# Altium schematic sheet main.SchDoc: 2306-rj45-connector
size 420 x 297 mm; Date: 2021-12-08; Author: Joachim Löfwander; Revision: AAA-000; SheetNumber: 1; SheetTotal: 1; Website: github.com/jlofw
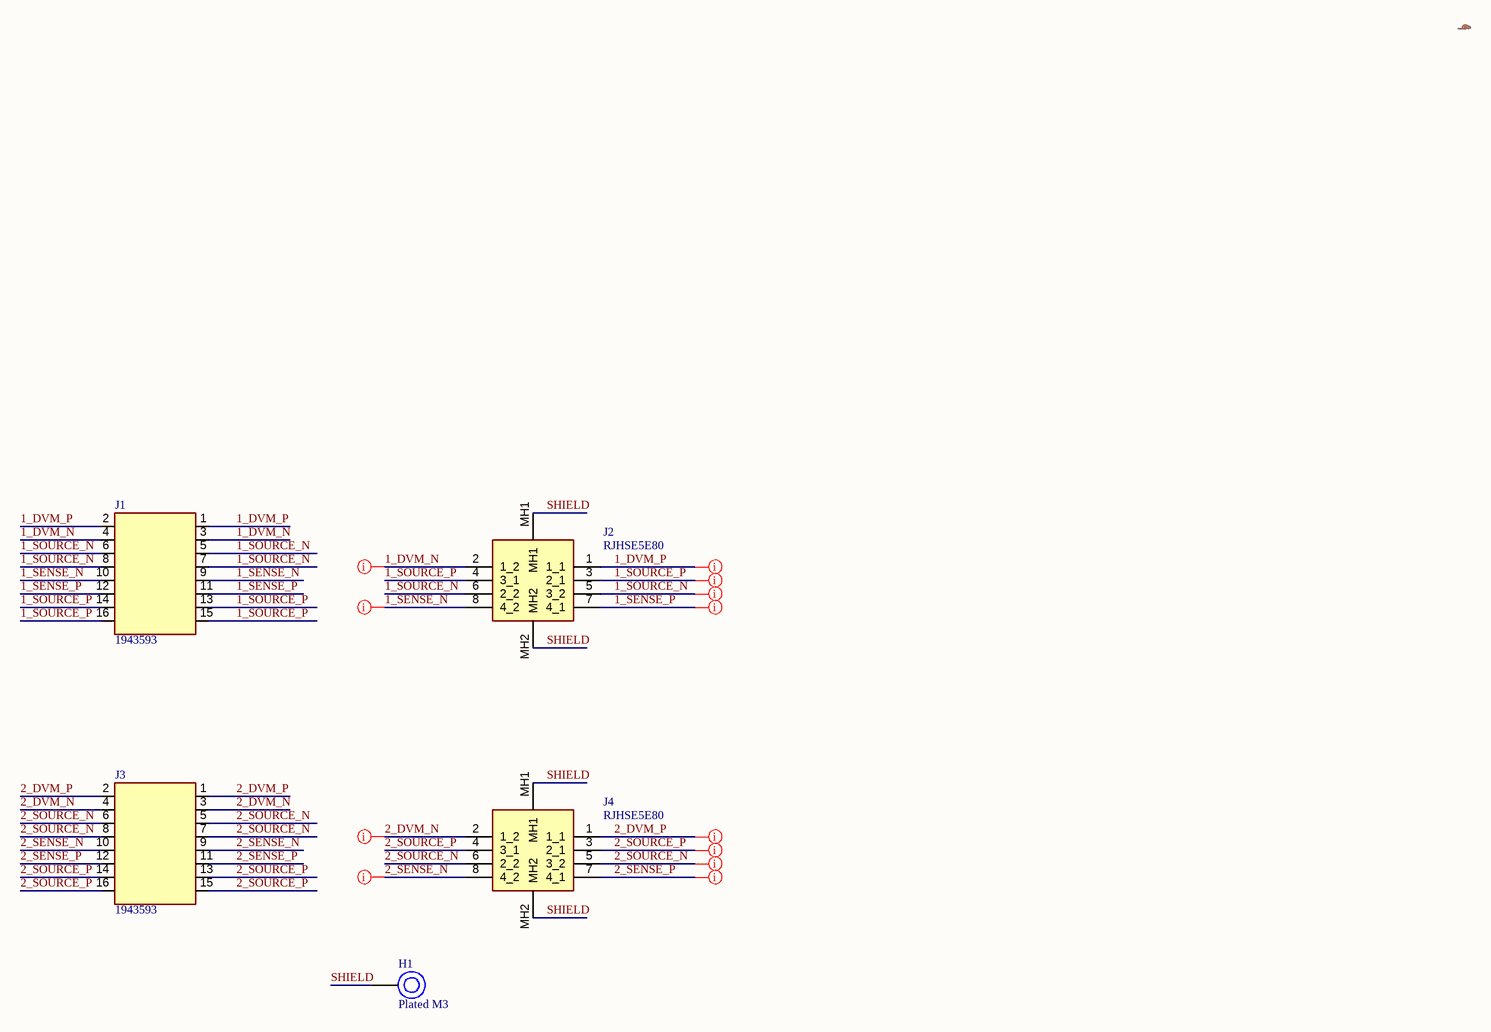
[diagram p0: main.SchDoc]

## Parts
H1  Plated M3  [MountingHole_3.2mm_M3_Pad_Via_Unplated]  (no BOM)
J1  Manufacturer P/N: 1943593  [phoenix_1943593]  (hidden comment: phoenix_1943593)
J2  Manufacturer P/N: RJHSE5E80  [amphenol_RJHSE5E80]  (hidden comment: amphenol_RJHSE5E80)
J3  Manufacturer P/N: 1943593  [phoenix_1943593]  (hidden comment: phoenix_1943593)
J4  Manufacturer P/N: RJHSE5E80  [amphenol_RJHSE5E80]  (hidden comment: amphenol_RJHSE5E80)
logo1  beaver  [beaver]  (value not drawn)

## Nets
1_DVM_N: J1.3(2.1) J1.4(2.2) J2.2(1_2)
1_DVM_P: J1.1(1.1) J1.2(1.2) J2.1(1_1)
1_SENSE_N: J1.9(5.1) J1.10(5.2) J2.8(4_2)
1_SENSE_P: J1.11(6.1) J1.12(6.2) J2.7(4_1)
1_SOURCE_N: J1.5(3.1) J1.6(3.2) J1.7(4.1) J1.8(4.2) J2.5(3_2) J2.6(2_2)
1_SOURCE_P: J1.13(7.1) J1.14(7.2) J1.15(8.1) J1.16(8.2) J2.3(2_1) J2.4(3_1)
2_DVM_N: J3.3(2.1) J3.4(2.2) J4.2(1_2)
2_DVM_P: J3.1(1.1) J3.2(1.2) J4.1(1_1)
2_SENSE_N: J3.9(5.1) J3.10(5.2) J4.8(4_2)
2_SENSE_P: J3.11(6.1) J3.12(6.2) J4.7(4_1)
2_SOURCE_N: J3.5(3.1) J3.6(3.2) J3.7(4.1) J3.8(4.2) J4.5(3_2) J4.6(2_2)
2_SOURCE_P: J3.13(7.1) J3.14(7.2) J3.15(8.1) J3.16(8.2) J4.3(2_1) J4.4(3_1)
SHIELD: H1.1 J2.MH1 J2.MH2 J4.MH1 J4.MH2

## Layout directives
net class PowerNet: 1_DVM_N, 1_DVM_P, 1_SENSE_N, 1_SENSE_P, 1_SOURCE_N, 1_SOURCE_P, 2_DVM_N, 2_DVM_P, 2_SENSE_N, 2_SENSE_P, 2_SOURCE_N, 2_SOURCE_P

## Notes on the sheet
- PROJECT
- TITLE
- FILE NAME
- DATE MODIFIED
- SHEET
- REV
- OF
- AUTHOR
- WEBSITE

## Library data of the parts
H1 = 2: Internal Number: 2
J1 J3 = 110008: Block Header Female  5.08mm Vertical TH; Manufacturer: Phoenix Contact; Internal Number: 110008
J2 J4 = 110034: RJ45 90° Angle Right Shielded; Manufacturer: Amphenol ICC; Internal Number: 110034
logo1 = 1: Internal Number: 1